# EAGLE schematic ALM_m2 (EAGLE 5.07)
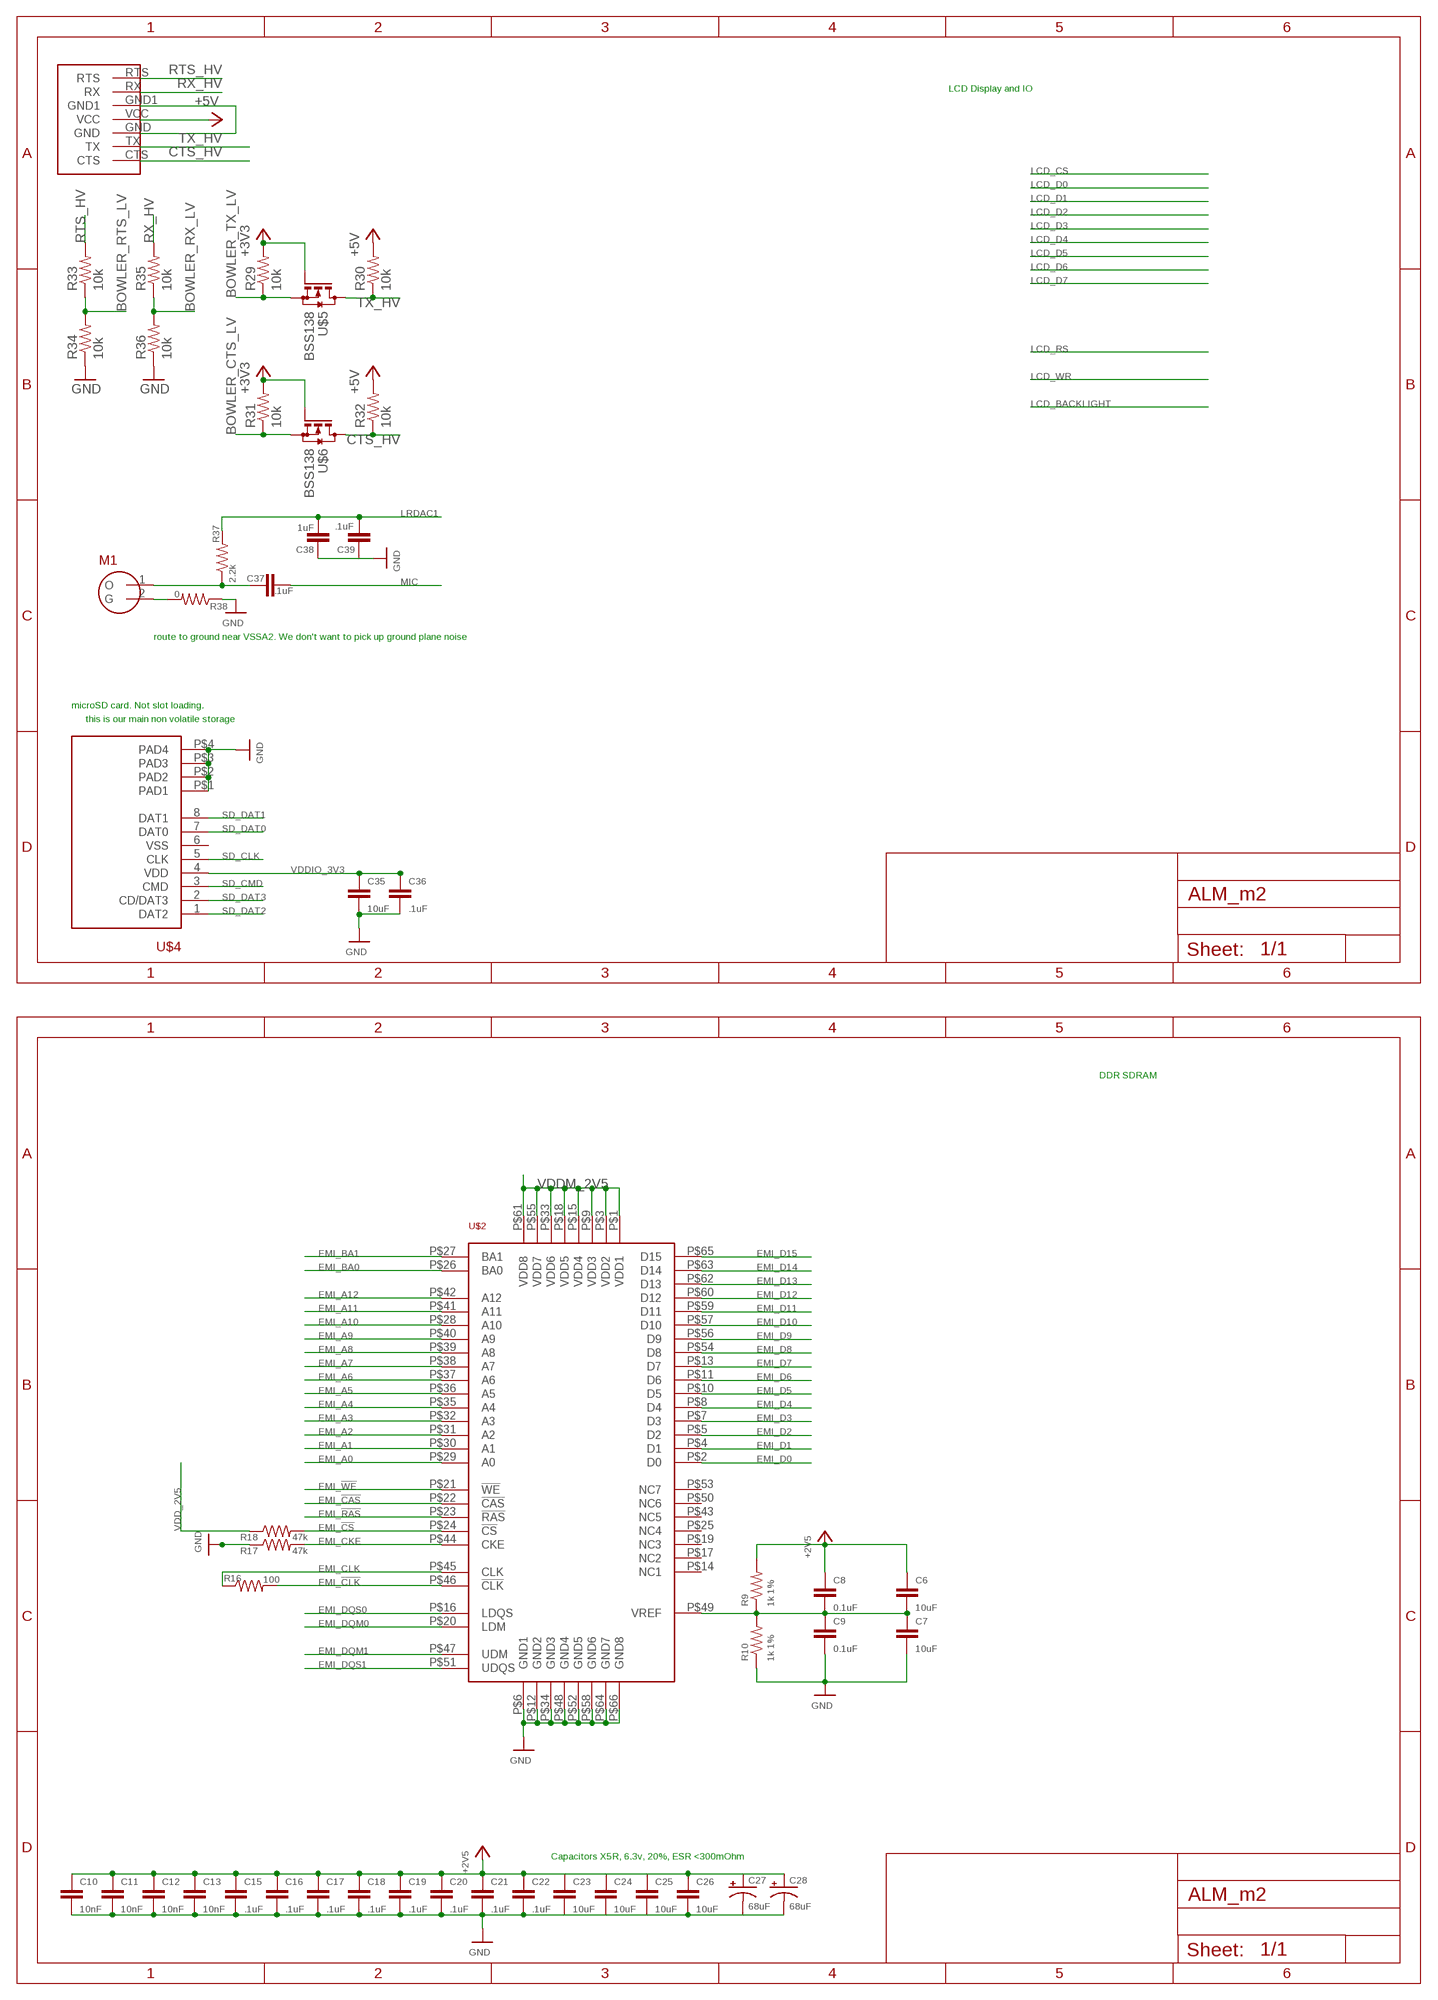
[diagram p0: schematic, sheet 1, part 1 of 3]
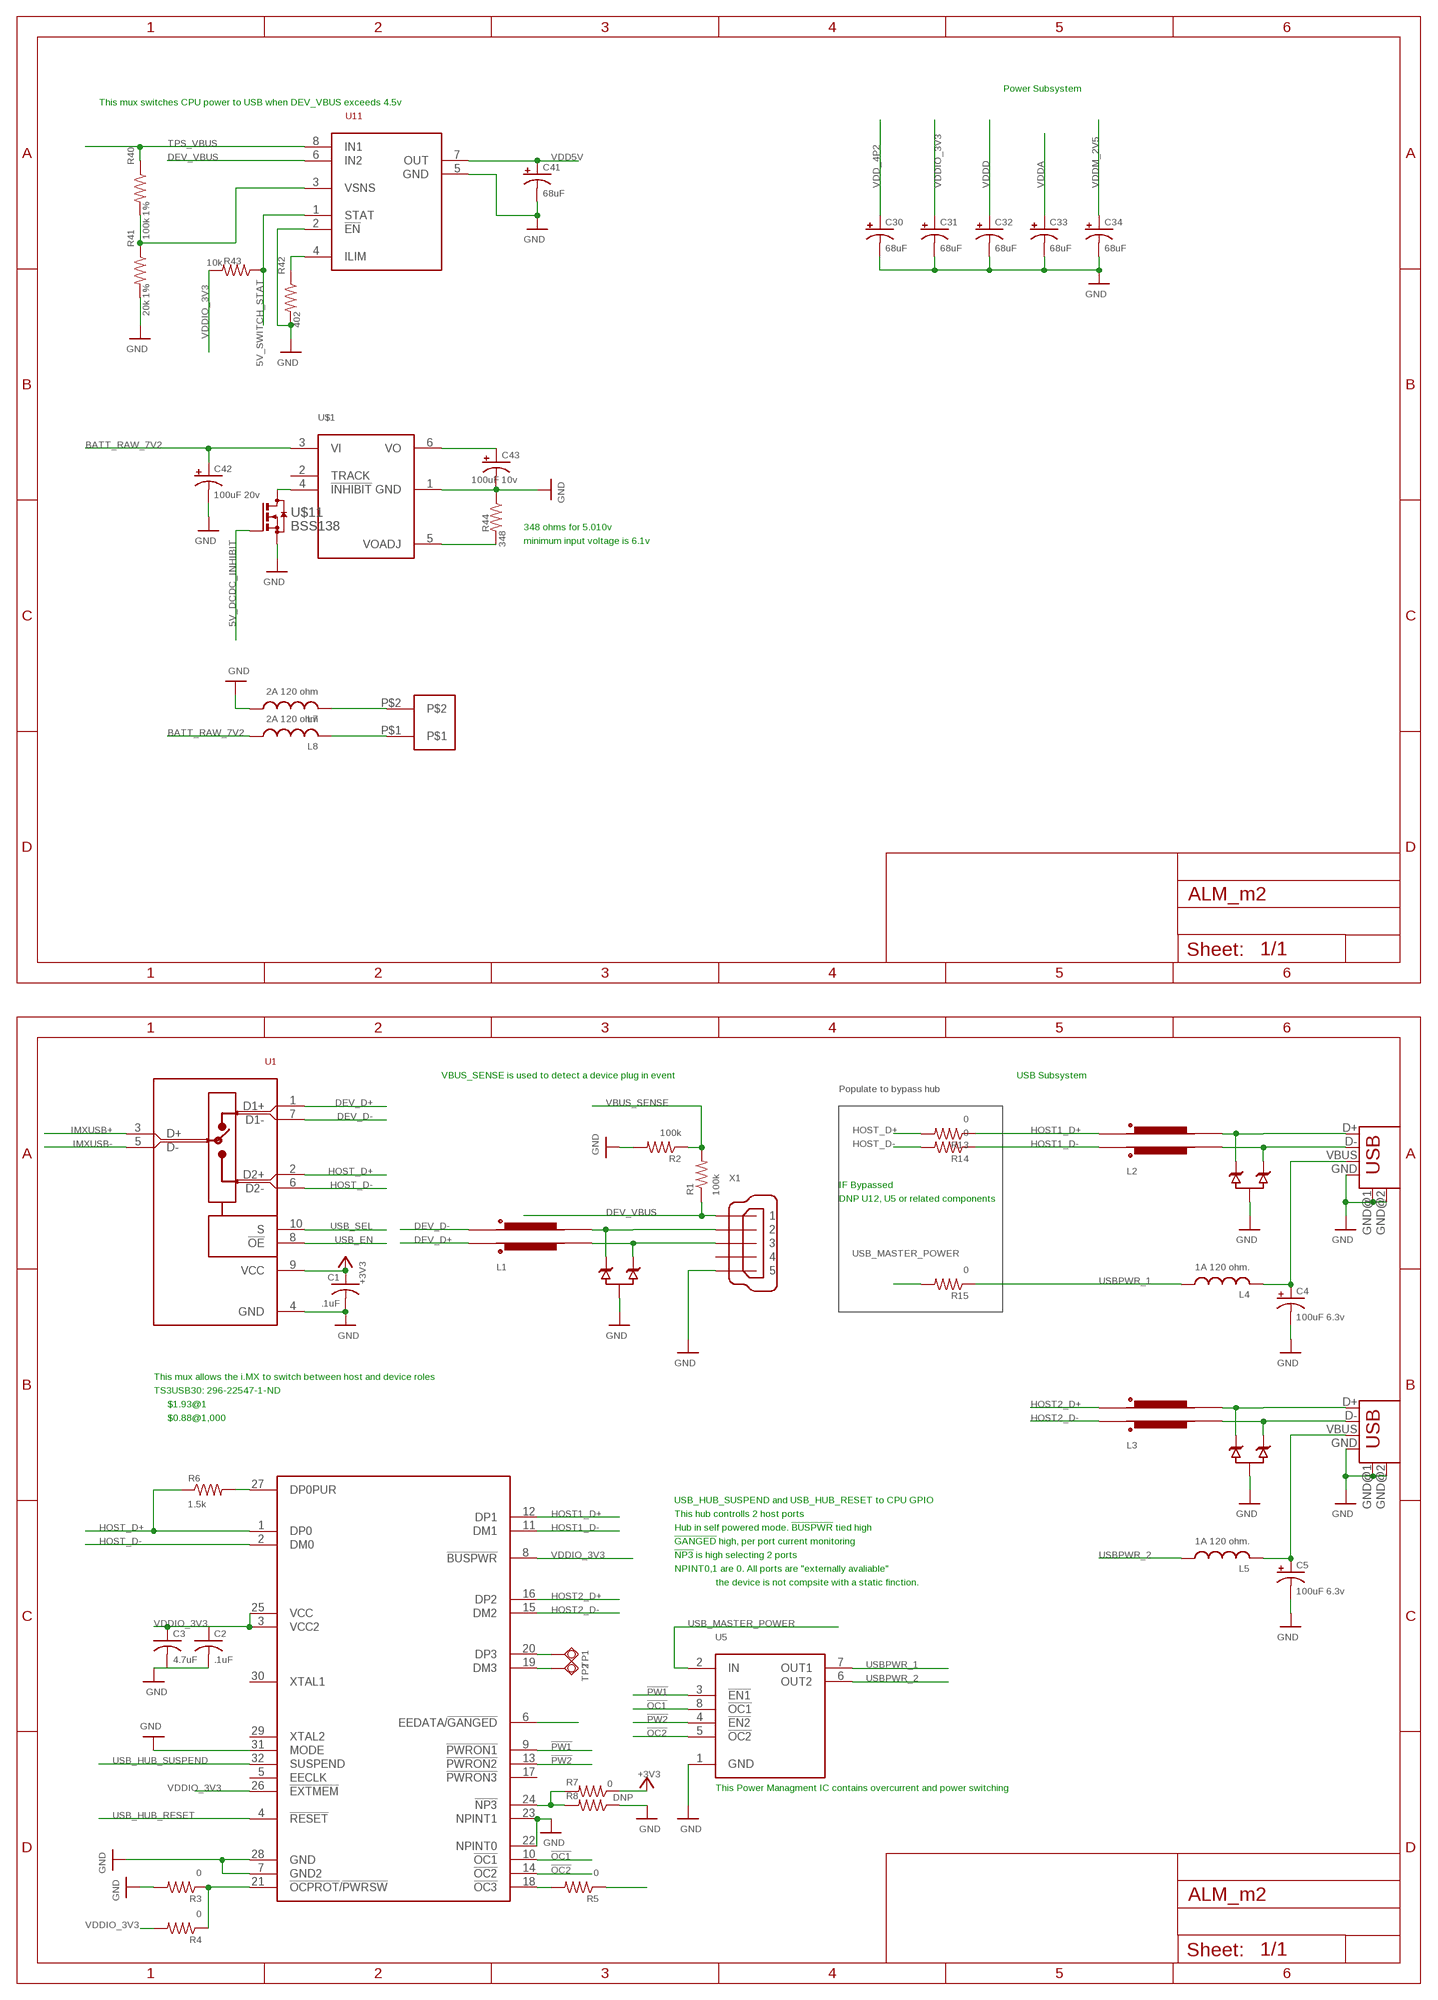
[diagram p1: schematic, sheet 1, part 2 of 3]
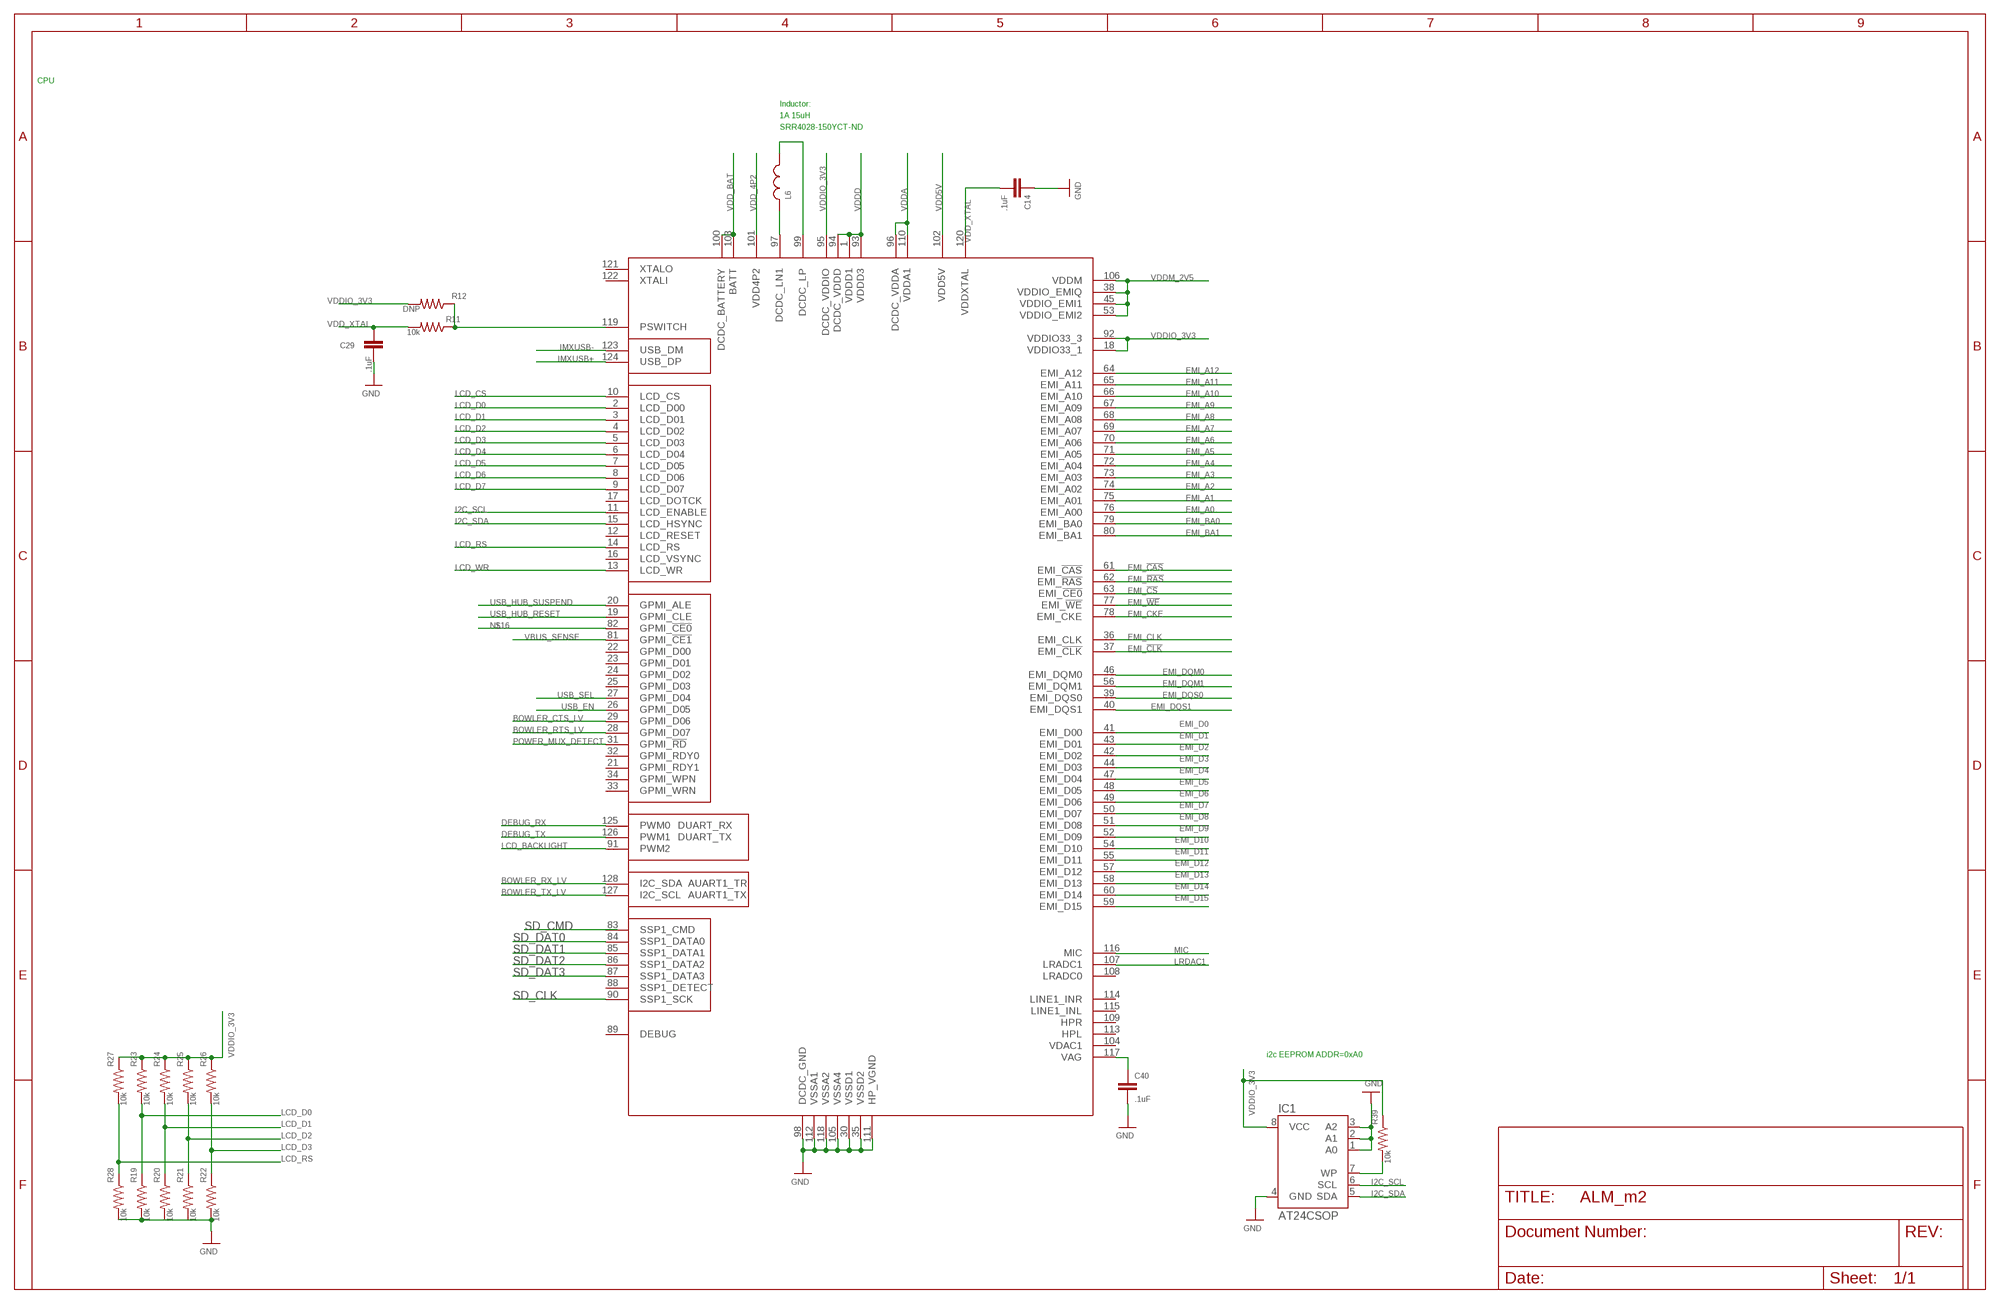
[diagram p2: schematic, sheet 1, part 3 of 3]

## Parts
C1  .1uF  C-USC0603  [C0603]
C2  .1uF  C-USC0603  [C0603]
C3  4.7uF  C-USC0603  [C0603]
C4  100uF 6.3v  CPOL-USE1.8-4  [E1,8-4]
C5  100uF 6.3v  CPOL-USE1.8-4  [E1,8-4]
C6  10uF  C-EUC0603  [C0603]
C7  10uF  C-EUC0603  [C0603]
C8  0.1uF  C-EUC0402  [C0402]
C9  0.1uF  C-EUC0402  [C0402]
C10  10nF  C-EUC0402  [C0402]
C11  10nF  C-EUC0402  [C0402]
C12  10nF  C-EUC0603  [C0603]
C13  10nF  C-EUC0402  [C0402]
C14  .1uF  C-EUC0402  [C0402]
C15  .1uF  C-EUC0402  [C0402]
C16  .1uF  C-EUC0402  [C0402]
C17  .1uF  C-EUC0402  [C0402]
C18  .1uF  C-EUC0402  [C0402]
C19  .1uF  C-EUC0402  [C0402]
C20  .1uF  C-EUC0402  [C0402]
C21  .1uF  C-EUC0402  [C0402]
C22  .1uF  C-EUC0402  [C0402]
C23  10uF  C-EUC0402  [C0402]
C24  10uF  C-EUC0402  [C0402]
C25  10uF  C-EUC0402  [C0402]
C26  10uF  C-EUC0402  [C0402]
C27  68uF  CPOL-US085CS-1AR  [085CS_1AR]
C28  68uF  CPOL-US085CS-1AR  [085CS_1AR]
C29  .1uF  C-EUC0402  [C0402]
C30  68uF  CPOL-US085CS-1AR  [085CS_1AR]
C31  68uF  CPOL-US085CS-1AR  [085CS_1AR]
C32  68uF  CPOL-US085CS-1AR  [085CS_1AR]
C33  68uF  CPOL-US085CS-1AR  [085CS_1AR]
C34  68uF  CPOL-US085CS-1AR  [085CS_1AR]
C35  10uF  C-EUC0402  [C0402]
C36  .1uF  C-EUC0402  [C0402]
C37  .1uF  C-EUC0402  [C0402]
C38  1uF  C-EUC0402  [C0402]
C39  .1uF  C-EUC0402  [C0402]
C40  .1uF  C-EUC0402  [C0402]
C41  68uF  CPOL-US085CS-1AR  [085CS_1AR]
C42  100uF 20v  CPOL-US085CS-1AR  [085CS_1AR]
C43  100uF 10v  CPOL-US085CS-1AR  [085CS_1AR]
IC1  AT24CSOP  [TSSOP8]
L1  FERITE_S0805  [SPLIT_0805]
L2  FERITE_S0805  [SPLIT_0805]
L3  FERITE_S0805  [SPLIT_0805]
L4  1A 120 ohm.  L-USL2825P  [L2825P]
L5  1A 120 ohm.  L-USL2825P  [L2825P]
L6  INDUCTOR  [SRR4028]
L7  2A 120 ohm  L-USL2825P  [L2825P]
L8  2A 120 ohm  L-USL2825P  [L2825P]
M1  CMA-4544PF-W  [CMA-4544PF-W]
R1  100k  R-US_R0603  [R0603]
R2  100k  R-US_R0603  [R0603]
R3  0  R-US_R0603  [R0603]
R4  0  R-US_R0603  [R0603]
R5  0  R-US_R0603  [R0603]
R6  1.5k  R-US_R0603  [R0603]
R7  0  R-US_R0603  [R0603]
R8  DNP  R-US_R0603  [R0603]
R9  1k 1%  R-US_R0402  [R0402]
R10  1k 1%  R-US_R0402  [R0402]
R11  10k  R-US_R0603  [R0603]
R12  DNP  R-US_R0603  [R0603]
R13  0  R-US_R0603  [R0603]
R14  0  R-US_R0603  [R0603]
R15  0  R-US_R0603  [R0603]
R16  100  R-US_R0603  [R0603]
R17  47k  R-US_R0603  [R0603]
R18  47k  R-US_R0603  [R0603]
R19  10k  R-US_R0603  [R0603]
R20  10k  R-US_R0603  [R0603]
R21  10k  R-US_R0603  [R0603]
R22  10k  R-US_R0603  [R0603]
R23  10k  R-US_R0603  [R0603]
R24  10k  R-US_R0603  [R0603]
R25  10k  R-US_R0603  [R0603]
R26  10k  R-US_R0603  [R0603]
R27  10k  R-US_R0603  [R0603]
R28  10k  R-US_R0603  [R0603]
R29  10k  R-US_R0603  [R0603]
R30  10k  R-US_R0603  [R0603]
R31  10k  R-US_R0603  [R0603]
R32  10k  R-US_R0603  [R0603]
R33  10k  R-US_R0603  [R0603]
R34  10k  R-US_R0603  [R0603]
R35  10k  R-US_R0603  [R0603]
R36  10k  R-US_R0603  [R0603]
R37  2.2k  R-US_R0402  [R0402]
R38  0  R-US_R0402  [R0402]
R39  10k  R-US_R0603  [R0603]
R40  100k 1%  R-US_R0603  [R0603]
R41  20k 1%  R-US_R0603  [R0603]
R42  402  R-US_R0603  [R0603]
R43  10k  R-US_R0603  [R0603]
R44  348  R-US_R0603  [R0603]
TP1  TPSQB1,27  [B1,27]
TP2  TPSQB1,27  [B1,27]
U1  TS3USB30E  [TQFP10]
U2  RCLAMP0502B  [SOT-523]
U3  RCLAMP0502B  [SOT-523]
U4  RCLAMP0502B  [SOT-523]
U5  TPS2042BDR  [SO08]
U11  TPS2113A  [TSSOP8]
U12  TUSB2036  [S-PQFP-G32]
U$1  PTH08000W  [PTH08000W]
U$2  DDR_SDRAM_X16  [66TSOP2]
U$3  IMX233TQFP  [14MM_128TQFP_E0.40]
U$4  101-00303  [AMPHENOL_USD]
U$5  BSS138  [SOT23]
U$6  BSS138  [SOT23]
U$10  WASP7PIN  [WASP7PIN]
U$11  BSS138  [SOT23]
U$12  2P  [2PTH]
USB1  USB-A-H  [USB-A-H]
USB2  USB-A-H  [USB-A-H]
X1  MINI-USB-SHIELD-UX60-MB-5S8  [UX60-MB-5S8]

## Nets
5V_DCDC_INHIBIT: U$11.1(G)
5V_SWITCH_STAT: R43.1 U11.1(STAT)
!OC1: U5.8(!OC1) U12.10(!OC1)
!OC2: U5.5(!OC2) U12.14(!OC2)
!PW1: U5.3(!EN1) U12.9(!PWRON1)
!PW2: U5.4(!EN2) U12.13(!PWRON2)
+3V3: C1.1 C6.1 C8.1 C10.1 C11.1 C12.1 C13.1 C15.1 C16.1 C17.1 C18.1 C19.1 C20.1 C21.1 C22.1 C26.1 C28.+ R7.1 R9.2 R29.2 R31.2 U1.9(VCC) U$5.1(G) U$6.1(G) ; supply symbol labelled +2V5
+5V: R30.2 R32.2 U$10.VCC
BATT_RAW_7V2: C42.+ L8.1 U$1.3(VI)
BOWLER_CTS_LV: R31.1 U$3.29(GPMI_D06) U$6.2(S)
BOWLER_RTS_LV: R33.1 R34.2 U$3.28(GPMI_D07)
BOWLER_RX_LV: R35.1 R36.2 U$3.128(I2C_SDA)
BOWLER_TX_LV: R29.1 U$3.127(I2C_SCL) U$5.2(S)
CTS_HV: R32.1 U$6.3(D) U$10.CTS
DCDC_LIN: L6.1 U$3.97(DCDC_LN1)
DCDC_LP: L6.2 U$3.99(DCDC_LP)
DEBUG_RX: U$3.125(PWM0)
DEBUG_TX: U$3.126(PWM1)
DEV_D+: L1.4 U1.1(D1+)
DEV_D+_UNFILTERED: X1.3
DEV_D-: L1.1 U1.7(D1-)
DEV_D-_UNFILTERED: L1.2 U2.2
DEV_VBUS: R1.1 U11.6(IN2) X1.1
EMI_!CAS: U$2.P$22(!CAS) U$3.61(EMI_!CAS)
EMI_!CLK: R16.2 U$2.P$46(!CLK) U$3.37(EMI_!CLK)
EMI_!CS: R18.2 U$2.P$24(!CS) U$3.63(EMI_!CE0)
EMI_!RAS: U$2.P$23(!RAS) U$3.62(EMI_!RAS)
EMI_!WE: U$2.P$21(!WE) U$3.77(EMI_!WE)
EMI_A0: U$2.P$29(A0) U$3.76(EMI_A00)
EMI_A1: U$2.P$30(A1) U$3.75(EMI_A01)
EMI_A2: U$2.P$31(A2) U$3.74(EMI_A02)
EMI_A3: U$2.P$32(A3) U$3.73(EMI_A03)
EMI_A4: U$2.P$35(A4) U$3.72(EMI_A04)
EMI_A5: U$2.P$36(A5) U$3.71(EMI_A05)
EMI_A6: U$2.P$37(A6) U$3.70(EMI_A06)
EMI_A7: U$2.P$38(A7) U$3.69(EMI_A07)
EMI_A8: U$2.P$39(A8) U$3.68(EMI_A08)
EMI_A9: U$2.P$40(A9) U$3.67(EMI_A09)
EMI_A10: U$2.P$28(A10) U$3.66(EMI_A10)
EMI_A11: U$2.P$41(A11) U$3.65(EMI_A11)
EMI_A12: U$2.P$42(A12) U$3.64(EMI_A12)
EMI_BA0: U$2.P$26(BA0) U$3.79(EMI_BA0)
EMI_BA1: U$2.P$27(BA1) U$3.80(EMI_BA1)
EMI_CKE: R17.2 U$2.P$44(CKE) U$3.78(EMI_CKE)
EMI_CLK: R16.1 U$2.P$45(CLK) U$3.36(EMI_CLK)
EMI_D0: U$2.P$2(D0) U$3.41(EMI_D00)
EMI_D1: U$2.P$4(D1) U$3.43(EMI_D01)
EMI_D2: U$2.P$5(D2) U$3.42(EMI_D02)
EMI_D3: U$2.P$7(D3) U$3.44(EMI_D03)
EMI_D4: U$2.P$8(D4) U$3.47(EMI_D04)
EMI_D5: U$2.P$10(D5) U$3.48(EMI_D05)
EMI_D6: U$2.P$11(D6) U$3.49(EMI_D06)
EMI_D7: U$2.P$13(D7) U$3.50(EMI_D07)
EMI_D8: U$2.P$54(D8) U$3.51(EMI_D08)
EMI_D9: U$2.P$56(D9) U$3.52(EMI_D09)
EMI_D10: U$2.P$57(D10) U$3.54(EMI_D10)
EMI_D11: U$2.P$59(D11) U$3.55(EMI_D11)
EMI_D12: U$2.P$60(D12) U$3.57(EMI_D12)
EMI_D13: U$2.P$62(D13) U$3.58(EMI_D13)
EMI_D14: U$2.P$63(D14) U$3.60(EMI_D14)
EMI_D15: U$2.P$65(D15) U$3.59(EMI_D15)
EMI_DQM0: U$2.P$20(LDM) U$3.46(EMI_DQM0)
EMI_DQM1: U$2.P$47(UDM) U$3.56(EMI_DQM1)
EMI_DQS0: U$2.P$16(LDQS) U$3.39(EMI_DQS0)
EMI_DQS1: U$2.P$51(UDQS) U$3.40(EMI_DQS1)
GND: C1.2 C2.2 C4.- C5.- C7.2 C9.2 C10.2 C11.2 C12.2 C13.2 C14.1 C15.2 C16.2 C17.2 C18.2 C19.2 C20.2 C21.2 C22.2 C26.2 C28.- C29.2 C30.- C31.- C32.- C33.- C34.- C35.2 C36.2 C38.1 C40.2 C41.- C42.- C43.- IC1.1(A0) IC1.2(A1) IC1.3(A2) IC1.4(GND) L7.1 R2.2 R3.2 R8.1 R10.1 R17.1 R19.2 R22.2 R28.2 R34.1 R36.1 R38.1 R41.2 R42.2 R44.1 U1.4(GND) U2.3 U3.3 U4.3 U5.1(GND) U11.2(!EN) U11.5(GND) U12.7(GND2) U12.22(NPINT0) U12.23(NPINT1) U12.28(GND) U12.31(MODE) U$1.1(GND) U$2.P$6(GND1) U$2.P$12(GND2) U$2.P$34(GND3) U$2.P$48(GND4) U$2.P$52(GND5) U$2.P$58(GND6) U$2.P$64(GND7) U$2.P$66(GND8) U$3.30(VSSD1) U$3.35(VSSD2) U$3.98(DCDC_GND) U$3.105(VSSA4) U$3.111(HP_VGND) U$3.112(VSSA1) U$3.118(VSSA2) U$4.P$1(PAD1) U$4.P$2(PAD2) U$4.P$3(PAD3) U$4.P$4(PAD4) U$10.GND U$10.GND1 U$11.2(S) USB1.GND USB1.GND@1(GND) USB1.GND@2(GND) USB2.GND USB2.GND@1(GND) USB2.GND@2(GND) X1.5
HOST1_D+: L2.1 R13.1
HOST1_D+_UNFILTERED: L2.2 U3.2 USB1.D+
HOST1_D-: L2.4 R14.1
HOST1_D-_UNFILTERED: L2.3 U3.1 USB1.D-
HOST2_D+: L3.1
HOST2_D+_UNFILTERED: USB2.D+
HOST2_D-: L3.4
HOST2_D-_UNFILTERED: L3.3 U4.1 USB2.D-
HOST_D+: R6.1 R13.2 U1.2(D2+) U12.1(DP0)
HOST_D-: R14.2 U1.6(D2-) U12.2(DM0)
I2C_SCL: IC1.6(SCL) U$3.11(LCD_ENABLE)
I2C_SDA: IC1.5(SDA) U$3.15(LCD_HSYNC)
IMXUSB+: U1.3(D+) U$3.124(USB_DP)
IMXUSB-: U1.5(D-) U$3.123(USB_DM)
LCD_BACKLIGHT: U$3.91(PWM2)
LCD_CS: U$3.10(LCD_CS)
LCD_D0: R19.1 R23.2 U$3.2(LCD_D00)
LCD_D1: R20.1 R24.2 U$3.3(LCD_D01)
LCD_D2: R21.1 R25.2 U$3.4(LCD_D02)
LCD_D3: R22.1 R26.2 U$3.5(LCD_D03)
LCD_D4: U$3.6(LCD_D04)
LCD_D5: U$3.7(LCD_D05)
LCD_D6: U$3.8(LCD_D06)
LCD_D7: U$3.9(LCD_D07)
LCD_RS: R27.2 R28.1 U$3.14(LCD_RS)
LCD_WR: U$3.13(LCD_WR)
LRDAC1: C38.2 C39.2 R37.2 U$3.107(LRADC1)
MIC: C37.2 U$3.116(MIC)
N$1: R3.1 R4.1 U12.21(!OCPROT!/!PWRSW)
N$2: L1.3 U2.1
N$3: R5.2 U12.18(!OC3)
N$4: X1.2
N$5: TP1.TP U12.20(DP3)
N$6: TP2.TP U12.19(DM3)
N$7: R6.2 U12.27(DP0PUR)
N$8: M1.2(G) R38.2
N$9: L3.2 U4.2
N$10: C4.+ L4.2 USB1.VBUS
N$11: R7.2 R8.2 U12.24(!NP3)
N$12: C5.+ L5.2 USB2.VBUS
N$13: R11.1 R12.1 U$3.119(PSWITCH)
N$14: C37.1 M1.1(O) R37.1
N$15: R5.1
N$16: U$3.82(GPMI_!CE0)
N$17: IC1.7(WP) R39.2
N$18: C40.1 U$3.117(VAG)
N$19: R42.1 U11.4(ILIM)
N$20: L8.2 U$12.P$1
N$21: R40.2 R41.1 U11.3(VSNS)
N$22: C43.+ U$1.6(VO)
N$23: L7.2 U$12.P$2
N$24: R44.2 U$1.5(VOADJ)
N$25: U$1.4(!INHIBIT) U$11.3(D)
N$29: C6.2 C7.1 C8.2 C9.1 R9.1 R10.2 U$2.P$49(VREF)
POWER_MUX_DETECT: U$3.31(GPMI_!RD)
RTS_HV: R33.2 U$10.RTS
RX_HV: R35.2 U$10.RX
TPS_VBUS: R40.1 U11.8(IN1)
TX_HV: R30.1 U$5.3(D) U$10.TX
USB_EN: U1.8(!OE) U$3.26(GPMI_D05)
USB_HUB_RESET: U12.4(!RESET) U$3.19(GPMI_CLE)
USB_HUB_SUSPEND: U12.32(SUSPEND) U$3.20(GPMI_ALE)
USB_MASTER_POWER: R15.2 U5.2(IN)
USB_SEL: U1.10(S) U$3.27(GPMI_D04)
USBPWR_1: L4.1 R15.1 U5.7(OUT1)
USBPWR_2: L5.1 U5.6(OUT2)
VBUS_SENSE: R1.2 R2.1 U$3.81(GPMI_!CE1)
VDD5V: C41.+ U11.7(OUT) U$3.102(VDD5V)
VDD_2V5: R18.1
VDD_4P2: C30.+ U$3.101(VDD4P2)
VDD_BAT: U$3.100(DCDC_BATTERY) U$3.103(BATT)
VDD_XTAL: C14.2 C29.1 R11.2 U$3.120(VDDXTAL)
VDDA: C33.+ U$3.96(DCDC_VDDA) U$3.110(VDDA1)
VDDD: C32.+ U$3.1(VDDD1) U$3.93(VDDD3) U$3.94(DCDC_VDDD)
VDDIO_3V3: C3.1 C31.+ C35.1 C36.1 IC1.8(VCC) R4.2 R12.2 R23.1 R24.1 R25.1 R26.1 R27.1 R39.1 R43.2 U12.3(VCC2) U12.6(EEDATA/!GANGED) U12.8(!BUSPWR) U12.25(VCC) U12.26(!EXTMEM) U$3.18(VDDIO33_1) U$3.92(VDDIO33_3) U$3.95(DCDC_VDDIO) U$4.4(VDD)
VDDM_2V5: U$2.P$1(VDD1) U$2.P$3(VDD2) U$2.P$9(VDD3) U$2.P$15(VDD4) U$2.P$18(VDD5) U$2.P$33(VDD6) U$2.P$55(VDD7) U$2.P$61(VDD8) U$3.38(VDDIO_EMIQ) U$3.45(VDDIO_EMI1) U$3.53(VDDIO_EMI2) U$3.106(VDDM)
Unconnected: C2.1 C3.2 C23.1 C23.2 C24.1 C24.2 C25.1 C25.2 C27.+ C27.- C34.+ C39.1 R20.2 R21.2 U12.5(EECLK) U12.11(DM1) U12.12(DP1) U12.15(DM2) U12.16(DP2) U12.17(!PWRON3) U12.29(XTAL2) U12.30(XTAL1) U$1.2(TRACK) U$2.P$14(NC1) U$2.P$17(NC2) U$2.P$19(NC3) U$2.P$25(NC4) U$2.P$43(NC5) U$2.P$50(NC6) U$2.P$53(NC7) U$3.12(LCD_RESET) U$3.16(LCD_VSYNC) U$3.17(LCD_DOTCK) U$3.21(GPMI_RDY1) U$3.22(GPMI_D00) U$3.23(GPMI_D01) U$3.24(GPMI_D02) U$3.25(GPMI_D03) U$3.32(GPMI_RDY0) U$3.33(GPMI_WRN) U$3.34(GPMI_WPN) U$3.83(SSP1_CMD) U$3.84(SSP1_DATA0) U$3.85(SSP1_DATA1) U$3.86(SSP1_DATA2) U$3.87(SSP1_DATA3) U$3.88(SSP1_DETECT) U$3.89(DEBUG) U$3.90(SSP1_SCK) U$3.104(VDAC1) U$3.108(LRADC0) U$3.109(HPR) U$3.113(HPL) U$3.114(LINE1_INR) U$3.115(LINE1_INL) U$3.121(XTALO) U$3.122(XTALI) U$4.1(DAT2) U$4.2(CD/DAT3) U$4.3(CMD) U$4.5(CLK) U$4.6(VSS) U$4.7(DAT0) U$4.8(DAT1) X1.4 X1.M1(S1) X1.M2(S2) X1.M3(S3) X1.M4(S4)

## Notes on the sheet
- LCD Display and IO | Power Subsystem | CPU
- This mux switches CPU power to USB when DEV_VBUS exceeds 4.5v
- Inductor:
- 1A 15uH
- SRR4028-150YCT-ND
- 348 ohms for 5.010v
- minimum input voltage is 6.1v
- route to ground near VSSA2. We don't want to pick up ground plane noise
- microSD card. Not slot loading.
- this is our main non volatile storage
- DDR SDRAM | VBUS_SENSE is used to detect a device plug in event | USB Subsystem
- Populate to bypass hub
- IF Bypassed
- DNP U12, U5 or related components
- i2c EEPROM ADDR=0xA0
- This mux allows the i.MX to switch between host and device roles
- TS3USB30: 296-22547-1-ND
- $1.93@1
- $0.88@1,000
- USB_HUB_SUSPEND and USB_HUB_RESET to CPU GPIO
- This hub controlls 2 host ports
- Hub in self powered mode. !BUSPWR! tied high
- !GANGED! high, per port current monitoring
- !NP3! is high selecting 2 ports
- NPINT0,1 are 0. All ports are "externally avaliable"
- the device is not compsite with a static finction.
- This Power Managment IC contains overcurrent and power switching
- Capacitors X5R, 6.3v, 20%, ESR <300mOhm

## Library data of the parts
C1-C3 = rcl:C-US: CAPACITOR, American symbol
C4 C5 = rcl:CPOL-US: POLARIZED CAPACITOR, American symbol
C6-C26 C29 C35-C40 = rcl:C-EU: CAPACITOR, European symbol
C27 C28 C30-C34 C41-C43 = resistor:CPOL-US: POLARIZED CAPACITOR, American symbol
IC1 = at24cxx:AT24C*: 2-wire serial EEPROM
L1-L3 = ferrite_split_0805:FERITE_S0805
L4 L5 L7 L8 = rcl:L-US: INDUCTOR, American symbol
L6 = Inductor_SRR4028:INDUCTOR
M1 = CMA-4544PF-W:CMA-4544PF-W
R1-R44 = rcl:R-US_: RESISTOR, American symbol
TP1 TP2 = testpad:TPSQ: Test pad
U1 = TS3USB30:TS3USB30E
U2-U4 = rclamp0502b:RCLAMP0502B
U5 = TPS2042BDR:TPS2042BDR
U11 = tps2113a:TPS2113A
U12 = tusb2036:TUSB2036
U$1 = PTH0800W:PTH08000W
U$2 = DDR_SDRAM:DDR_SDRAM_X16
U$3 = imx233:IMX233TQFP
U$4 = amphenol_101-00303_usd:101-00303
U$5 U$6 U$11 = WASP:BSS138
U$10 = wasp7pin:WASP7PIN
U$12 = con_2h_70555-0001:2P
USB1 USB2 = con-usb-2:USB: USB Connectors
X1 = con-hirose:MINI-USB-SHIELD-: MINI USB Connector Source: http://www.hirose.co.jp/cataloge_hp/e24000019.pdf